# Altium schematic sheet LED_Driver - 3.SchDoc
size A3
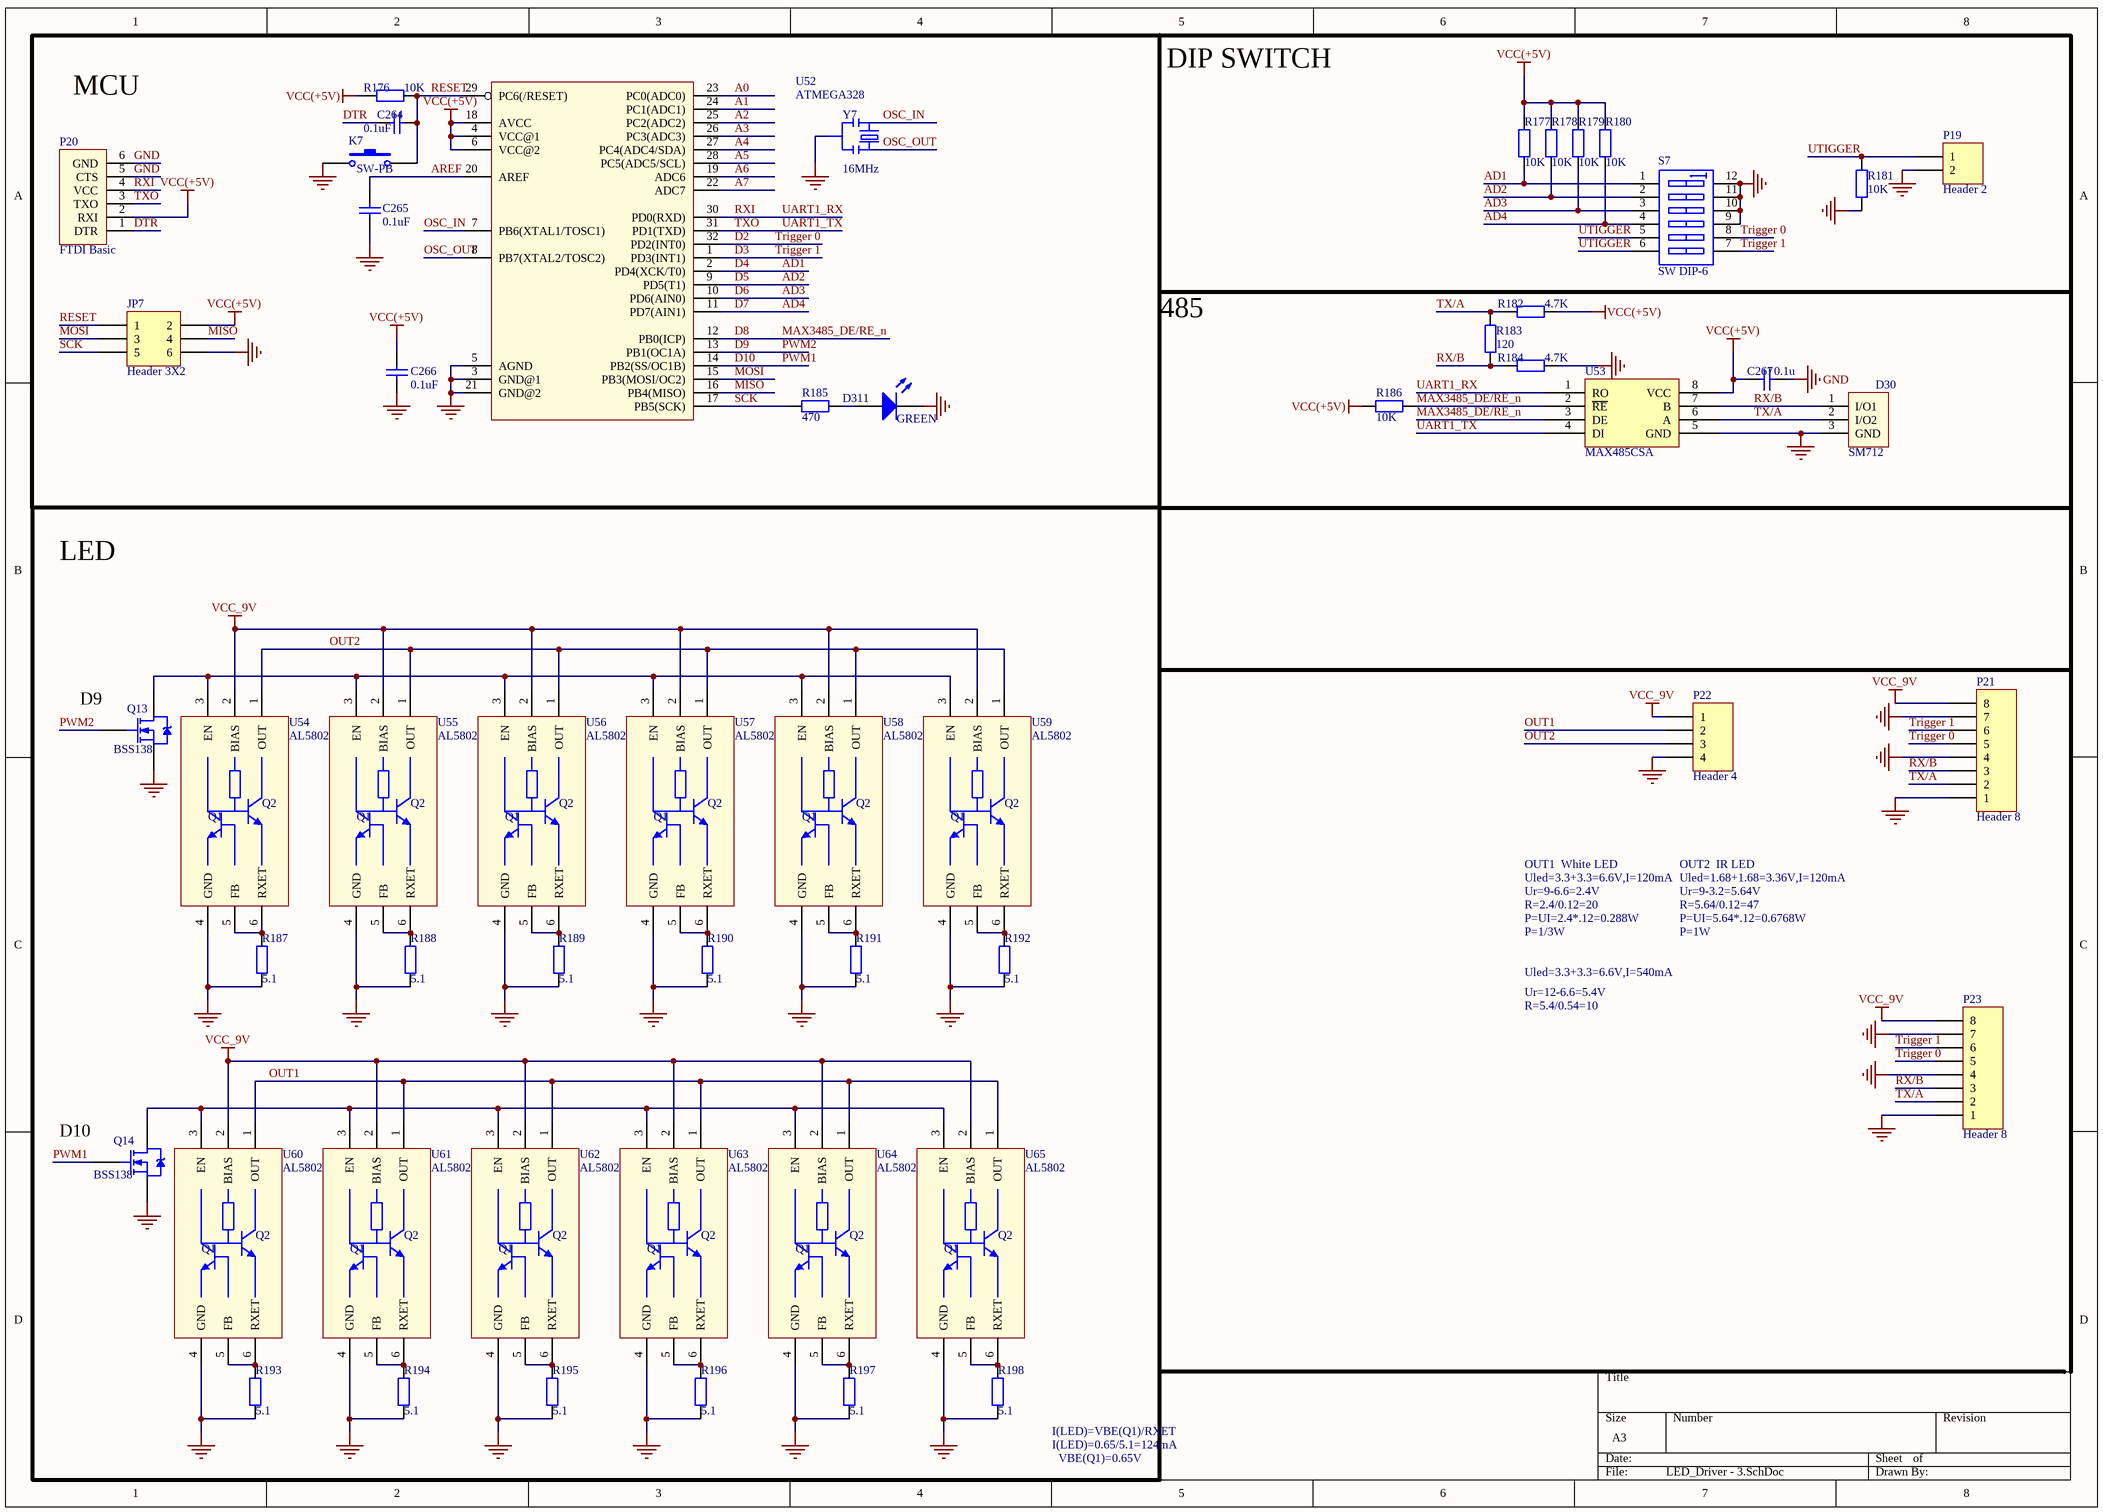
[diagram p0: LED_Driver - 3.SchDoc]

## Parts
C264  0.1uF  [C0603]
C265  0.1uF  [C0603]
C266  0.1uF  [C0603]
C267  0.1u  [C0603]
D30  SM712  [SOT23-3]
D31  GREEN  [LED0805]
JP7  Header 3X2  [MHDR1X6]
K7  SW-PB  [157SW]
P19  Header 2  [HDR1X2]
P20  FTDI Basic  [MHDR1X6]
P21  Header 8  [SH_1.25MM*8]
P22  Header 4  [SMT_1.25MM*4]
P23  Header 8  [SH_1.25MM*8]
Q13  BSS138  [SOT-23 (Standard)]
Q14  BSS138  [SOT-23 (Standard)]
R176  10K  [R0603]
R177  10K  [R0603]
R178  10K  [R0603]
R179  10K  [R0603]
R180  10K  [R0603]
R181  10K  [R0603]
R182  4.7K  [R0603]
R183  120  [R0603]
R184  4.7K  [R0603]
R185  470  [R0603]
R186  10K  [R0603]
R187  5.1  [R0603]
R188  5.1  [R0603]
R189  5.1  [R0603]
R190  5.1  [R0603]
R191  5.1  [R0603]
R192  5.1  [R0603]
R193  5.1  [R0603]
R194  5.1  [R0603]
R195  5.1  [R0603]
R196  5.1  [R0603]
R197  5.1  [R0603]
R198  5.1  [R0603]
S7  SW DIP-6  [DIP_SW_6WAY_SMD]
U52  ATMEGA328  [TQFP32-08]
U53  MAX485CSA  [SOIC-8]
U54  AL5802  [SOT26]
U55  AL5802  [SOT26]
U56  AL5802  [SOT26]
U57  AL5802  [SOT26]
U58  AL5802  [SOT26]
U59  AL5802  [SOT26]
U60  AL5802  [SOT26]
U61  AL5802  [SOT26]
U62  AL5802  [SOT26]
U63  AL5802  [SOT26]
U64  AL5802  [SOT26]
U65  AL5802  [SOT26]
Y7  16MHz  [RESONATOR-SMD]

## Blocks framed on the sheet
LED: Q13 Q14 R187-R198 U54-U65

## Nets
GND: C265.1 C266.2 C267.1 D30.3(GND) D31.2(K) JP7.6 K7.1 P19.2 P20.5(CTS) P20.6(GND) P21.1 P21.4 P21.7 P22.4 P23.1 P23.4 P23.7 Q13.S Q14.S R181.1 R184.1 R187.2 R188.2 R189.2 R190.2 R191.2 R192.2 R193.2 R194.2 R195.2 R196.2 R197.2 R198.2 S7.9(B4) S7.10(B3) S7.11(B2) S7.12(B1) U52.3(GND@1) U52.5(AGND) U52.21(GND@2) U53.5(GND) U54.4(GND) U55.4(GND) U56.4(GND) U57.4(GND) U58.4(GND) U59.4(GND) U60.4(GND) U61.4(GND) U62.4(GND) U63.4(GND) U64.4(GND) U65.4(GND) Y7.2
VCC(+5V): C266.1 C267.2 JP7.2 P20.2(RXI) R176.1 R177.1 R178.1 R179.1 R180.1 R182.1 R186.2 U52.4(VCC@1) U52.6(VCC@2) U52.18(AVCC) U53.8(VCC)
VCC_9V: P21.8 P22.1 P23.8 U54.2(BIAS) U55.2(BIAS) U56.2(BIAS) U57.2(BIAS) U58.2(BIAS) U59.2(BIAS) U60.2(BIAS) U61.2(BIAS) U62.2(BIAS) U63.2(BIAS) U64.2(BIAS) U65.2(BIAS)
A0: U52.23(PC0(ADC0))
A1: U52.24(PC1(ADC1))
A2: U52.25(PC2(ADC2))
A3: U52.26(PC3(ADC3))
A4: U52.27(PC4(ADC4/SDA))
A5: U52.28(PC5(ADC5/SCL))
A6: U52.19(ADC6)
A7: U52.22(ADC7)
AD1: R177.2 S7.1(A1) U52.2(PD4(XCK/T0))  [also labelled D4]
AD2: R178.2 S7.2(A2) U52.9(PD5(T1))  [also labelled D5]
AD3: R179.2 S7.3(A3) U52.10(PD6(AIN0))  [also labelled D6]
AD4: R180.2 S7.4(A4) U52.11(PD7(AIN1))  [also labelled D7]
AREF: C265.2 U52.20(AREF)
D2: P21.5 P23.5 S7.8(B5) U52.32(PD2(INT0))  [also labelled Trigger 0]
D3: P21.6 P23.6 S7.7(B6) U52.1(PD3(INT1))  [also labelled Trigger 1]
D8: R186.1 U52.12(PB0(ICP)) U53.2(~{RE}) U53.3(DE)  [also labelled MAX3485_DE/RE_n]
D9: Q13.G U52.13(PB1(OC1A))  [also labelled PWM2]
D10: Q14.G U52.14(PB2(SS/OC1B))  [also labelled PWM1]
DTR: C264.1 P20.1(DTR)
MISO: JP7.4 U52.16(PB4(MISO))
MOSI: JP7.3 U52.15(PB3(MOSI/OC2))
OSC_IN: U52.7(PB6(XTAL1/TOSC1)) Y7.3
OSC_OUT: U52.8(PB7(XTAL2/TOSC2)) Y7.1
OUT1: P22.2 U60.1(OUT) U61.1(OUT) U62.1(OUT) U63.1(OUT) U64.1(OUT) U65.1(OUT)
OUT2: P22.3 U54.1(OUT) U55.1(OUT) U56.1(OUT) U57.1(OUT) U58.1(OUT) U59.1(OUT)
RESET: C264.2 JP7.1 K7.2 R176.2 U52.29(PC6(/RESET))
RX/B: D30.1(I/O1) P21.3 P23.3 R183.2 R184.2 U53.7(B)
RXI: P20.4(VCC) U52.30(PD0(RXD)) U53.1(RO)  [also labelled UART1_RX]
SCK: JP7.5 R185.1 U52.17(PB5(SCK))
TX/A: D30.2(I/O2) P21.2 P23.2 R182.2 R183.1 U53.6(A)
TXO: P20.3(TXO) U52.31(PD1(TXD)) U53.4(DI)  [also labelled UART1_TX]
UTIGGER: P19.1 R181.2 S7.5(A5) S7.6(A6)
NetD31_1: D31.1(A) R185.2
NetQ13_D: Q13.D U54.3(EN) U55.3(EN) U56.3(EN) U57.3(EN) U58.3(EN) U59.3(EN)
NetQ14_D: Q14.D U60.3(EN) U61.3(EN) U62.3(EN) U63.3(EN) U64.3(EN) U65.3(EN)
NetR187_1: R187.1 U54.5(FB) U54.6(RXET)
NetR188_1: R188.1 U55.5(FB) U55.6(RXET)
NetR189_1: R189.1 U56.5(FB) U56.6(RXET)
NetR190_1: R190.1 U57.5(FB) U57.6(RXET)
NetR191_1: R191.1 U58.5(FB) U58.6(RXET)
NetR192_1: R192.1 U59.5(FB) U59.6(RXET)
NetR193_1: R193.1 U60.5(FB) U60.6(RXET)
NetR194_1: R194.1 U61.5(FB) U61.6(RXET)
NetR195_1: R195.1 U62.5(FB) U62.6(RXET)
NetR196_1: R196.1 U63.5(FB) U63.6(RXET)
NetR197_1: R197.1 U64.5(FB) U64.6(RXET)
NetR198_1: R198.1 U65.5(FB) U65.6(RXET)

## Notes on the sheet
- MCU
- DIP SWITCH
- 485
- (near Q13) D9
- Uled=3.3+3.3=6.6V,I=120mA
- OUT1  White LED
- R=2.4/0.12=20
- P=UI=2.4*.12=0.288W
- Ur=9-6.6=2.4V
- Uled=1.68+1.68=3.36V,I=120mA
- OUT2  IR LED
- R=5.64/0.12=47
- P=UI=5.64*.12=0.6768W
- Ur=9-3.2=5.64V
- P=1/3W
- Uled=3.3+3.3=6.6V,I=540mA
- Ur=12-6.6=5.4V
- P=1W
- R=5.4/0.54=10
- (near Q14) D10
- I(LED)=VBE(Q1)/RXET
- I(LED)=0.65/5.1=124mA
- VBE(Q1)=0.65V
- (in symbol AL5802) Q2; Q1

## Library data of the parts
C264-C266 = CAP SMT C100nF25V10%X7R: Capacitor; Voltage: 25V; iPartNumber: C100nF25V10%X7R; Value: 0.1uF
C267 = Cap: Capacitor; Value: 100pF; Published: 8-Jun-2000; LatestRevisionDate: 17-Jul-2002; LatestRevisionNote: Re-released for DXP Platform.; PackageReference: RAD-0.3; Publisher: Altium Limited
D31 = LED0: Typical INFRARED GaAs LED; Published: 8-Jun-2000; LatestRevisionDate: 08-Jul-2005; LatestRevisionNote: Mech Layer 1 removed.; PackageReference: LED-0; Publisher: Altium Limited
JP7 = Header 3X2: Header, 3-Pin, Dual row; LatestRevisionDate: 17-Jul-2002; LatestRevisionNote: Re-released for DXP Platform.; Publisher: Altium Limited
K7 = SW-PB: Switch; Published: 24-Mar-1999; LatestRevisionDate: 17-Jul-2002; LatestRevisionNote: Re-released for DXP Platform.; PackageReference: SPST-2; Publisher: Altium Limited; PackageDescription: Switch; 2 Leads
P19 = Header 2: Header, 2-Pin; LatestRevisionDate: 17-Jul-2002; LatestRevisionNote: Re-released for DXP Platform.; Publisher: Altium Limited
P20 = ARDUINO_SERIAL_PROGRAMPTH
P21 P23 = Header 8: Header, 8-Pin; LatestRevisionDate: 17-Jul-2002; LatestRevisionNote: Re-released for DXP Platform.; Publisher: Altium Limited
P22 = Header 4: Header, 4-Pin; LatestRevisionDate: 17-Jul-2002; LatestRevisionNote: Re-released for DXP Platform.; Publisher: Altium Limited
Q13 Q14 = NMOS: Manufacturer: Fairchild Semiconductor; Manufacturer Part Number: BSS123; FET Type: MOSFET N-Channel, Metal Oxide; FET Feature: Logic Level Gate; Drain to Source Voltage (Vdss): 100V; Current - Continuous Drain (Id) @ 25°C: 170mA (Ta); Rds On (Max) @ Id, Vgs: 6 Ohm @ 170mA, 10V; Vgs(th) (Max) @ Id: 2V @ 1mA; Gate Charge (Qg) @ Vgs: 2.5nC @ 10V; Input Capacitance (Ciss) @ Vds: 73pF @ 25V; Power - Max: 360mW; Supplier 1: Digi-Key; Supplier Part Number 1: BSS123NCT-ND; RoHS: RoHS Compliant; Category: Discrete Semiconductor Products; Stock 1: 163946; Pricing 1: 1=0.24, 10=0.216, 25=0.1556, 100=0.1211, 250=0.07612, 500=0.06484, 1000=0.04418 (USD); Packaging: Cut Tape (CT); Mounting Type: Surface Mount; Package / Case: TO-236-3, SC-59, SOT-23-3; Supplier Device Package: SOT-23; ComponentLink1URL: http://www.fairchildsemi.com/datasheets/BS/BSS123.pdf; ComponentLink1Description: http://www.fairchildsemi.com/datasheets/BS/BSS123.pdf
R176-R180 R182-R198 = Res2: Resistor
R181 = Res2: Resistor; Value: 1k; Published: 8-Jun-2000; LatestRevisionDate: 17-Jul-2002; LatestRevisionNote: Re-released for DXP Platform.; PackageReference: AXIAL-0.4; Publisher: Altium Limited
S7 = SW DIP-6: DIP Switch, 6 Position, SPST; Published: 24-Mar-1999; LatestRevisionDate: 17-Jul-2002; LatestRevisionNote: Re-released for DXP Platform.; PackageReference: DIP-12/SW; Publisher: Altium Limited
U52 = ATMEGA168
U53 = MAX3485CSA
Y7 = RESONATORSMD